# Altium schematic sheet Main.SchDoc
size A; SheetNumber: 1; SheetTotal: 7; ENG_APP_DATE: --/--/--; DSN_APP_DATE: --/--/--; CHK_APP_DATE: --/--/--
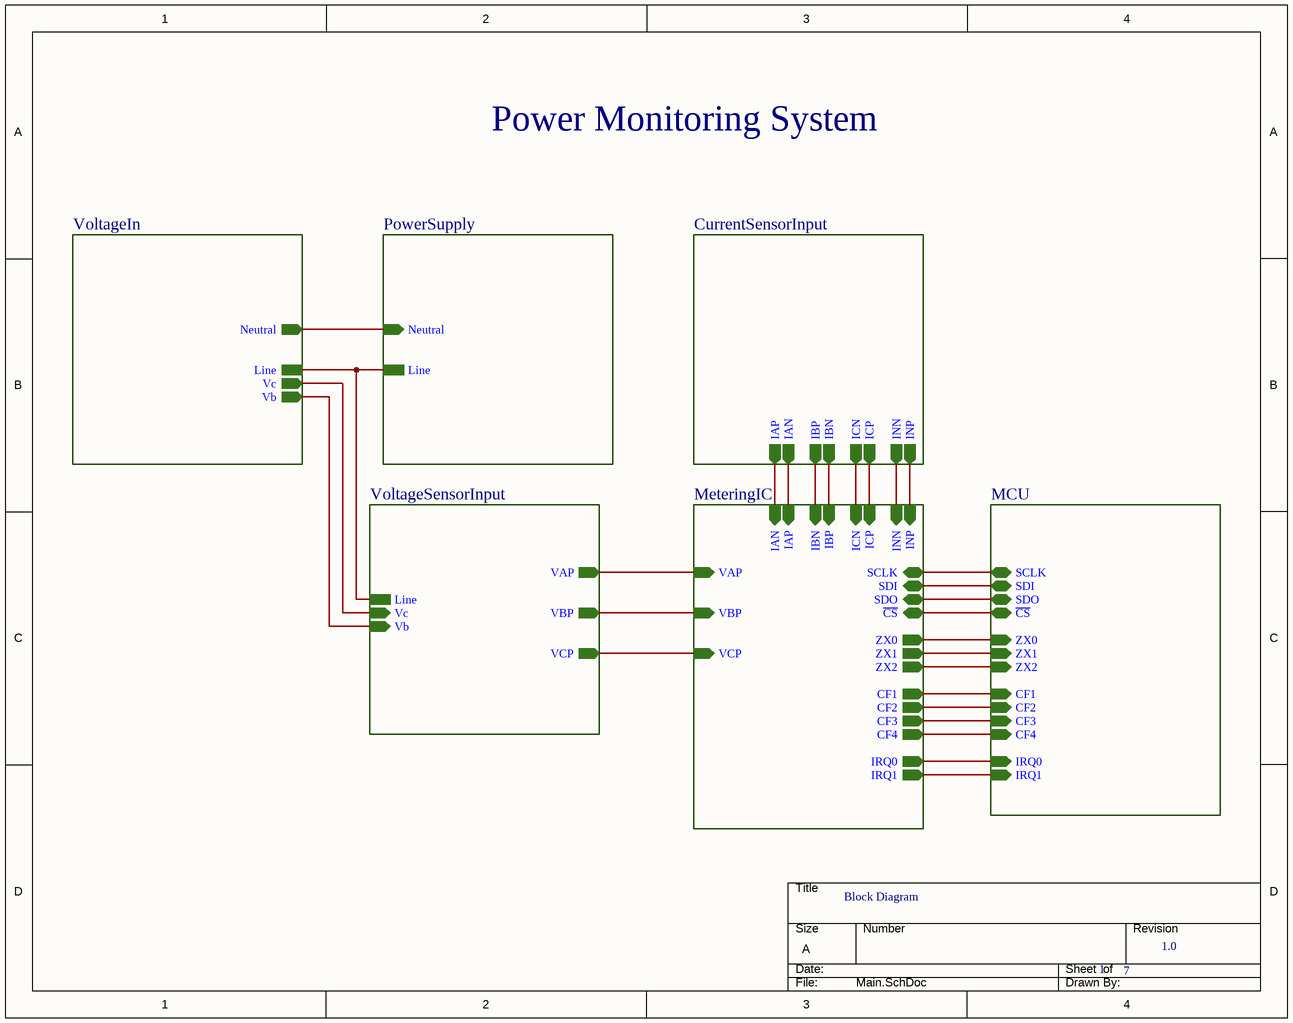
[diagram p0: Main.SchDoc]

## Sub-sheets
CurrentSensorInput = CurrentSensorInput.SchDoc: IAP (out), IAN (out), IBP (out), IBN (out), INP (out), INN (out), ICN (out), ICP (out)
MCU = MCU.SchDoc: SCLK (bidir), SDI (bidir), SDO (bidir), ~{CS} (bidir), ZX0 (in), ZX1 (in), ZX2 (in), CF1 (in), CF2 (in), CF3 (in), CF4 (in), IRQ0 (in), IRQ1 (in)
MeteringIC = MeteringIC.SchDoc: IAN (in), IAP (in), IBN (in), IBP (in), ICN (in), ICP (in), INN (in), INP (in), VAP (in), VBP (in), VCP (in), SDI (bidir), SCLK (bidir), SDO (bidir), ~{CS} (bidir), ZX0 (out), ZX1 (out), ZX2 (out), CF1 (out), CF2 (out), CF3 (out), CF4 (out), IRQ0 (out), IRQ1 (out)
PowerSupply = PowerSupply.SchDoc: Line, Neutral (in)
VoltageIn = VoltageIn.SchDoc: Neutral (out), Line, Vb (out), Vc (out)
VoltageSensorInput = VoltageSensorInput.SchDoc: VAP (out), VBP (out), VCP (out), Line, Vb (in), Vc (in)

## Nets
(unnamed): sheet VoltageIn/Neutral, sheet PowerSupply/Neutral
(unnamed): sheet VoltageIn/Line, sheet PowerSupply/Line, sheet VoltageSensorInput/Line
(unnamed): sheet VoltageIn/Vb, sheet VoltageSensorInput/Vb
(unnamed): sheet VoltageIn/Vc, sheet VoltageSensorInput/Vc
(unnamed): sheet CurrentSensorInput/IAP, sheet MeteringIC/IAN
(unnamed): sheet CurrentSensorInput/IAN, sheet MeteringIC/IAP
(unnamed): sheet CurrentSensorInput/IBP, sheet MeteringIC/IBN
(unnamed): sheet CurrentSensorInput/IBN, sheet MeteringIC/IBP
(unnamed): sheet CurrentSensorInput/INP, sheet MeteringIC/INP
(unnamed): sheet CurrentSensorInput/INN, sheet MeteringIC/INN
(unnamed): sheet CurrentSensorInput/ICN, sheet MeteringIC/ICN
(unnamed): sheet CurrentSensorInput/ICP, sheet MeteringIC/ICP
(unnamed): sheet MCU/SCLK, sheet MeteringIC/SCLK
(unnamed): sheet MCU/SDI, sheet MeteringIC/SDI
(unnamed): sheet MCU/SDO, sheet MeteringIC/SDO
(unnamed): sheet MCU/~{CS}, sheet MeteringIC/~{CS}
(unnamed): sheet MCU/ZX0, sheet MeteringIC/ZX0
(unnamed): sheet MCU/ZX1, sheet MeteringIC/ZX1
(unnamed): sheet MCU/ZX2, sheet MeteringIC/ZX2
(unnamed): sheet MCU/CF1, sheet MeteringIC/CF1
(unnamed): sheet MCU/CF2, sheet MeteringIC/CF2
(unnamed): sheet MCU/CF3, sheet MeteringIC/CF3
(unnamed): sheet MCU/CF4, sheet MeteringIC/CF4
(unnamed): sheet MCU/IRQ0, sheet MeteringIC/IRQ0
(unnamed): sheet MCU/IRQ1, sheet MeteringIC/IRQ1
(unnamed): sheet VoltageSensorInput/VAP, sheet MeteringIC/VAP
(unnamed): sheet VoltageSensorInput/VBP, sheet MeteringIC/VBP
(unnamed): sheet VoltageSensorInput/VCP, sheet MeteringIC/VCP

## Notes on the sheet
- Power Monitoring System
- Block Diagram
- 1
- 7
- 1.0
- DWG. NO.
- REV.
- SHT.
- THIS DOCUMENT AND THE DATA DISCLOSED HEREIN OR HEREWITH IS THE PROPERTY OF ALTIUM LIMITED AND MAY BE FREELY DISTRIBUTED IN WHOLE. NO RIGHTS ARE RESERVED OR EXPRESS OR IMPLIED WARANTEE GIVEN.
- REVISION
- DESCRIPTION
- DATE
- APPROVED
- ENG:
- APPROVALS
- PROJECT
- DSN:
- CHK:
- REFERENCE DOCUMENTS
- PROJECT REVISION:
- TITLE
- DOCUMENT REVISION:
- DESIGN ITEM:
- BOM:
- FAB DWG:
- PCB DWG:
- ASSY DWG:
- SCALE:
- SIZE
- B
- CAGE CODE
- FILE NAME
- DWG NO.
- SHEET
- OF
- REV